# Altium project HDSP_watch.PrjPcb
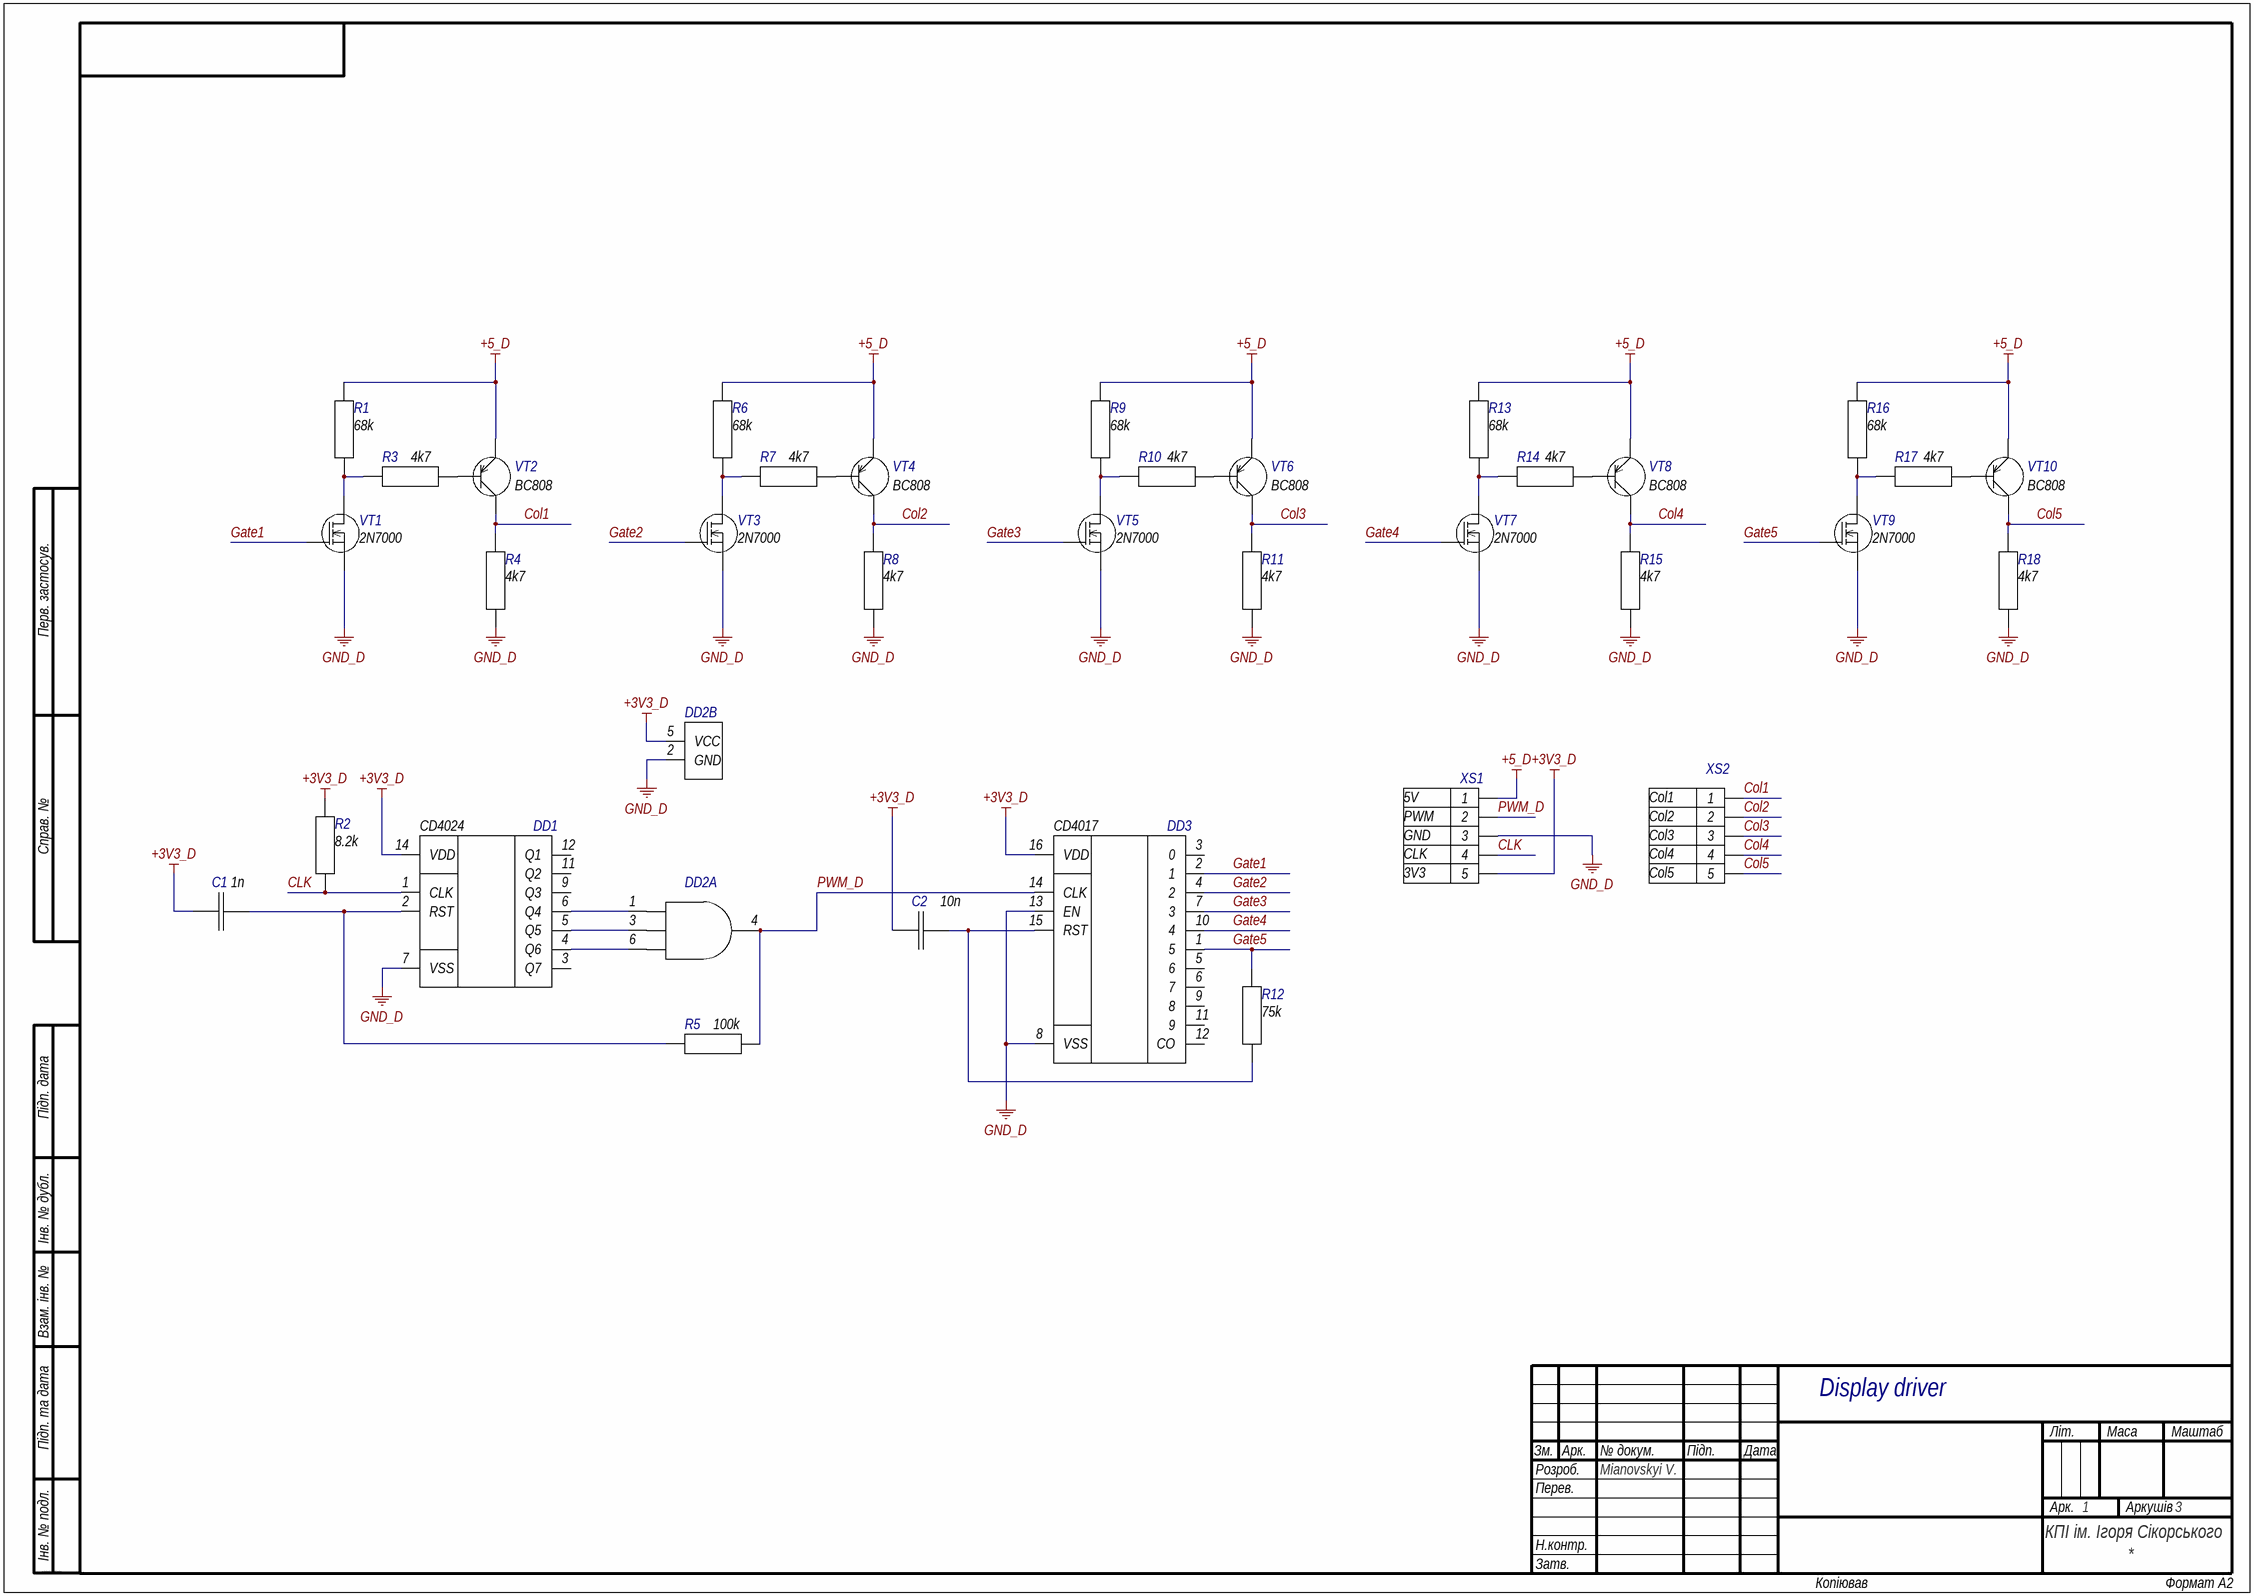
[diagram p0: Display_driver.SchDoc]
п_Разраб: Mianovskyi V.; п_Разраб_Р: Mianovskyi V.; п_Т_Контр: Mianovskyi V.
3 sheets, 86 parts. Net scope: global (net labels, ports and power ports of the same name join across sheets).
Board files: Control_core_copy.PcbDoc, Supply_core_PCB.PcbDoc, Display_driver_PCB.PcbDoc, Control_Supply_PCB.PcbDoc, Driver_PCB.PcbDoc
Sheets:
  Display_driver.SchDoc
  Supply_core.SchDoc
  Control_core.SchDoc

## Sheet Display_driver.SchDoc
size 594 x 420 mm; SheetNumber: 1; SheetTotal: 3

### Parts
C1  value 1n  [CHIP-0805]  (hidden comment: C0805)
C2  value 10n  [CHIP-0402]  (hidden comment: C0805)
DD1  CD4024  [SOIC-14]
DD2  74LVC1G11  [SOT23-6]  (value not drawn)  (parts A,B of 2)
DD3  CD4017  [SOIC-16]
R1  value 68k  [CHIP-0805]  (hidden comment: R0805)
R2  value 8.2k  [CHIP-0805]  (hidden comment: R0805)
R3  value 4k7  [CHIP-0402]  (hidden comment: R0805)
R4  value 4k7  [CHIP-0402]  (hidden comment: R0805)
R5  value 100k  [CHIP-0805]  (hidden comment: R0805)
R6  value 68k  [CHIP-0805]  (hidden comment: R0805)
R7  value 4k7  [CHIP-0402]  (hidden comment: R0805)
R8  value 4k7  [CHIP-0402]  (hidden comment: R0805)
R9  value 68k  [CHIP-0805]  (hidden comment: R0805)
R10  value 4k7  [CHIP-0402]  (hidden comment: R0805)
R11  value 4k7  [CHIP-0402]  (hidden comment: R0805)
R12  value 75k  [CHIP-0402]  (hidden comment: R0805)
R13  value 68k  [CHIP-0805]  (hidden comment: R0805)
R14  value 4k7  [CHIP-0402]  (hidden comment: R0805)
R15  value 4k7  [CHIP-0402]  (hidden comment: R0805)
R16  value 68k  [CHIP-0805]  (hidden comment: R0805)
R17  value 4k7  [CHIP-0402]  (hidden comment: R0805)
R18  value 4k7  [CHIP-0402]  (hidden comment: R0805)
VT1  2N7000  [SOT23-3]
VT2  BC808  [SOT23-3]
VT3  2N7000  [SOT23-3]
VT4  BC808  [SOT23-3]
VT5  2N7000  [SOT23-3]
VT6  BC808  [SOT23-3]
VT7  2N7000  [SOT23-3]
VT8  BC808  [SOT23-3]
VT9  2N7000  [SOT23-3]
VT10  BC808  [SOT23-3]
XS1  Pin5: 3V3  Pin4: CLK  Pin3: GND  Pin2: PWM  Pin1: 5V  [SOCKET]  (hidden comment: Socket)
XS2  Pin5: Col5  Pin4: Col4  Pin3: Col3  Pin2: Col2  Pin1: Col1  [SOCKET]  (hidden comment: Socket)

### Nets
+3V3_D: C1.1 C2.1 DD1.14(VDD) DD2.5(VCC) DD3.16(VDD) R2.2 XS1.5
+5_D: R1.2 R6.2 R9.2 R13.2 R16.2 VT2.2(E) VT4.2(E) VT6.2(E) VT8.2(E) VT10.2(E) XS1.1
GND_D: DD1.7(VSS) DD2.2(GND) DD3.8(VSS) DD3.13(EN) R4.1 R8.1 R11.1 R15.1 R18.1 VT1.2(S) VT3.2(S) VT5.2(S) VT7.2(S) VT9.2(S) XS1.3
CLK: DD1.1(CLK) R2.1 XS1.4
Col1: R4.2 VT2.3(C) XS2.1
Col2: R8.2 VT4.3(C) XS2.2
Col3: R11.2 VT6.3(C) XS2.3
Col4: R15.2 VT8.3(C) XS2.4
Col5: R18.2 VT10.3(C) XS2.5
Gate1: DD3.2(1) VT1.1(G)
Gate2: DD3.4(2) VT3.1(G)
Gate3: DD3.7(3) VT5.1(G)
Gate4: DD3.10(4) VT7.1(G)
Gate5: DD3.1(5) R12.2 VT9.1(G)
PWM_D: DD2.4(Y) DD3.14(CLK) R5.2 XS1.2
NetC1_2: C1.2 DD1.2(RST) R5.1
NetC2_2: C2.2 DD3.15(RST) R12.1
NetDD1_4: DD1.4(Q6) DD2.6(C)
NetDD1_5: DD1.5(Q5) DD2.3(B)
NetDD1_6: DD1.6(Q4) DD2.1(A)
NetR1_1: R1.1 R3.1 VT1.3(D)
NetR3_2: R3.2 VT2.1(B)
NetR6_1: R6.1 R7.1 VT3.3(D)
NetR7_2: R7.2 VT4.1(B)
NetR9_1: R9.1 R10.1 VT5.3(D)
NetR10_2: R10.2 VT6.1(B)
NetR13_1: R13.1 R14.1 VT7.3(D)
NetR14_2: R14.2 VT8.1(B)
NetR16_1: R16.1 R17.1 VT9.3(D)
NetR17_2: R17.2 VT10.1(B)

Not connected (* = marked no-connect by the designer): DD1 3(Q7) 9(Q3) 11(Q2) 12(Q1); DD3 3(0) 5(6) 6(7) 9(8) 11(9) 12(CO)

### Notes on the sheet
- Display driver
- Перв. застосув.
- Справ. №
- Підп. дата
- Інв. № дубл.
- Взам. інв. №
- Підп. та дата
- Зм.
- Розроб.
- Арк.
- № докум.
- Підп.
- Дата
- Літ.
- Маса
- Маштаб
- Перев.
- Аркушів
- Інв. № подл.
- Н.контр.
- Затв.
- КПІ ім. Ігоря Сікорського
- ALTIUM GOSTBOM2.0 KEV
- Копіював
- Формат А2

### Library data of the parts
DD1 = CD4024: Name: CD4024
DD3 = CD4017: Name: CD4017
VT1 VT3 VT5 VT7 VT9 = 2N7000: Name: 2N7000
VT2 VT4 VT6 VT8 VT10 = BC808: Name: BC808

## Sheet Supply_core.SchDoc
size 594 x 420 mm; SheetNumber: 2; SheetTotal: 3
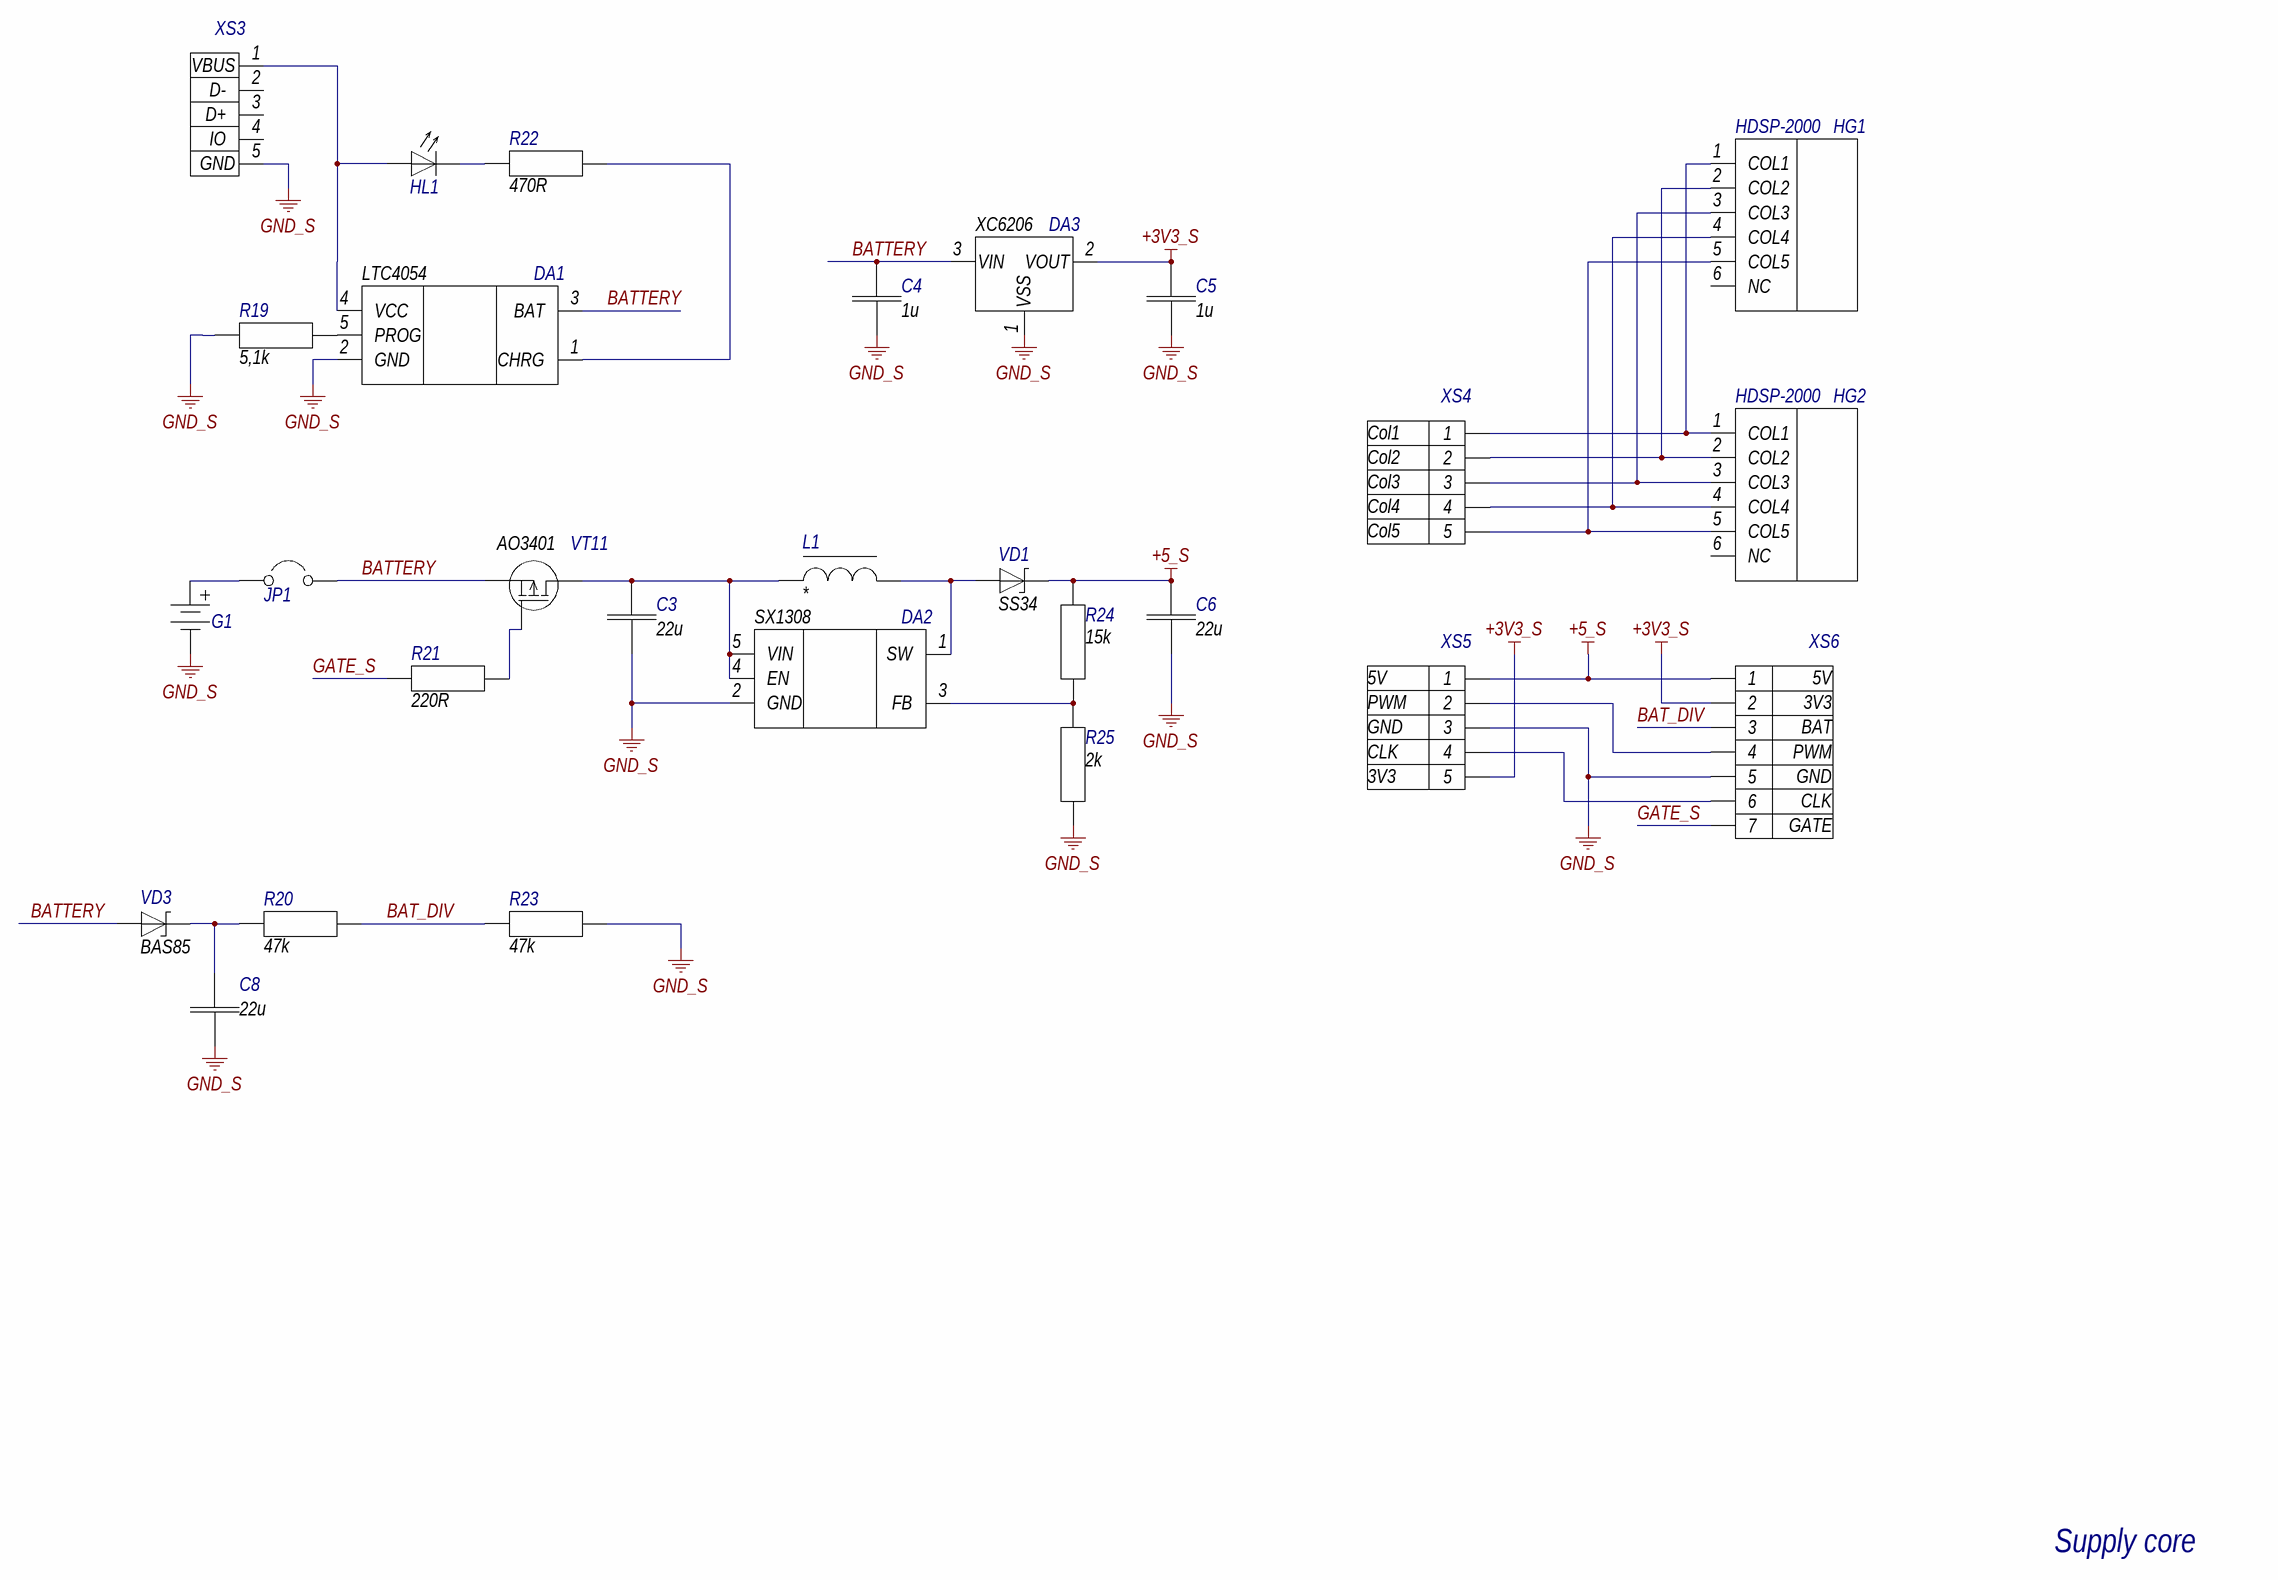
[diagram p1: Supply_core.SchDoc]

### Parts
C3  value 22u  [CHIP-0805]  (hidden comment: C0805)
C4  value 1u  [CHIP-0603]  (hidden comment: C0805)
C5  value 1u  [CHIP-0603]  (hidden comment: C0805)
C6  value 22u  [CHIP-0805]  (hidden comment: C0805)
C8  value 22u  [CHIP-0805]  (hidden comment: C0805)
DA1  LTC4054  [SOT23-5]
DA2  SX1308  [SOT23-6]
DA3  XC6206  [SOT23-3]
G1  Battery  [BATTERY]  (value not drawn)
HG1  Name: HDSP-2000  [HDSP-2000_COL]  (hidden comment: HDSP-2000_Colums)
HG2  Name: HDSP-2000  [HDSP-2000_COL]  (hidden comment: HDSP-2000_Colums)
HL1  LED  [LED_1]  (value not drawn)
JP1  Jamper  [JAMPER]  (value not drawn)
L1  L  [L_SMD]  (value not drawn)
R19  value 5,1k  [CHIP-0402]  (hidden comment: R0805)
R20  value 47k  [CHIP-0402]  (hidden comment: R0805)
R21  value 220R  [CHIP-0805]  (hidden comment: R0805)
R22  value 470R  [CHIP-0805]  (hidden comment: R0805)
R23  value 47k  [CHIP-0402]  (hidden comment: R0805)
R24  value 15k  [CHIP-0805]  (hidden comment: R0805)
R25  value 2k  [CHIP-0805]  (hidden comment: R0805)
VD1  SS34  [DIOD]
VD3  BAS85  [DIOD_MELF]
VT11  Name: AO3401  [SOT23-3]  (hidden comment: AO3401A)
XS3  Micro_USB  [Micro_USB]  (value not drawn)
XS4  Pin5: Col5  Pin4: Col4  Pin3: Col3  Pin2: Col2  Pin1: Col1  [SOCKET]  (hidden comment: Socket)
XS5  Pin5: 3V3  Pin4: CLK  Pin3: GND  Pin2: PWM  Pin1: 5V  [SOCKET]  (hidden comment: Socket)
XS6  Pin7: GATE  Pin6: CLK  Pin5: GND  Pin4: PWM  Pin3: BAT  Pin2: 3V3  Pin1: 5V  [SOCKET_7]  (hidden comment: Socket_7)

### Nets
+3V3_S: C5.2 DA3.2(VOUT) XS5.5 XS6.2
+5_S: C6.2 R24.2 VD1.1(K) XS5.1 XS6.1
GND_S: C3.1 C4.1 C5.1 C6.1 C8.1 DA1.2(GND) DA2.2(GND) DA3.1(VSS) G1.2 R19.1 R23.2 R25.1 XS3.5(GND) XS5.3 XS6.5
BAT_DIV: R20.2 R23.1 XS6.3
BATTERY: C4.2 DA1.3(BAT) DA3.3(VIN) JP1.2 VD3.2(A) VT11.2(S)
GATE_S: R21.1 XS6.7
NetC3_2: C3.2 DA2.4(EN) DA2.5(VIN) L1.1 VT11.3(D)
NetC8_2: C8.2 R20.1 VD3.1(K)
NetDA1_1: DA1.1(CHRG) R22.2
NetDA1_4: DA1.4(VCC) HL1.2(A) XS3.1(VBUS)
NetDA1_5: DA1.5(PROG) R19.2
NetDA2_1: DA2.1(SW) L1.2 VD1.2(A)
NetDA2_3: DA2.3(FB) R24.1 R25.2
NetG1_1: G1.1 JP1.1
NetHG1_1: HG1.1(COL1) HG2.1(COL1) XS4.1
NetHG1_2: HG1.2(COL2) HG2.2(COL2) XS4.2
NetHG1_3: HG1.3(COL3) HG2.3(COL3) XS4.3
NetHG1_4: HG1.4(COL4) HG2.4(COL4) XS4.4
NetHG1_5: HG1.5(COL5) HG2.5(COL5) XS4.5
NetHL1_1: HL1.1(K) R22.1
NetR21_2: R21.2 VT11.1(G)
NetXS5_2: XS5.2 XS6.4
NetXS5_4: XS5.4 XS6.6

Not connected (* = marked no-connect by the designer): HG1 6(NC); HG2 6(NC); XS3 2(D-) 3(D+) 4(IO)

### Notes on the sheet
- Supply core
- Перв. застосув.
- Справ. №
- Підп. дата
- Інв. № дубл.
- Взам. інв. №
- Підп. та дата
- Зм.
- Розроб.
- Арк.
- № докум.
- Підп.
- Дата
- Літ.
- Маса
- Маштаб
- Перев.
- Аркушів
- Інв. № подл.
- Н.контр.
- Затв.
- КПІ ім. Ігоря Сікорського
- ALTIUM GOSTBOM2.0 KEV
- Копіював
- Формат А2

### Library data of the parts
HG1 HG2 = HDSP-2000_Colums: Manufacturer: HP
DA1 = LTC4054: Name: LTC4054
DA2 = SX1308: Name: SX1308
DA3 = XC6206: Name: XC6206
HL1 = LED: Name: LED
L1 = L: Value: *
VD1 = SS34: Name: SS34
VD3 = BAS85: Name: BAS85

## Sheet Control_core.SchDoc
size 594 x 420 mm; SheetNumber: 3; SheetTotal: 3
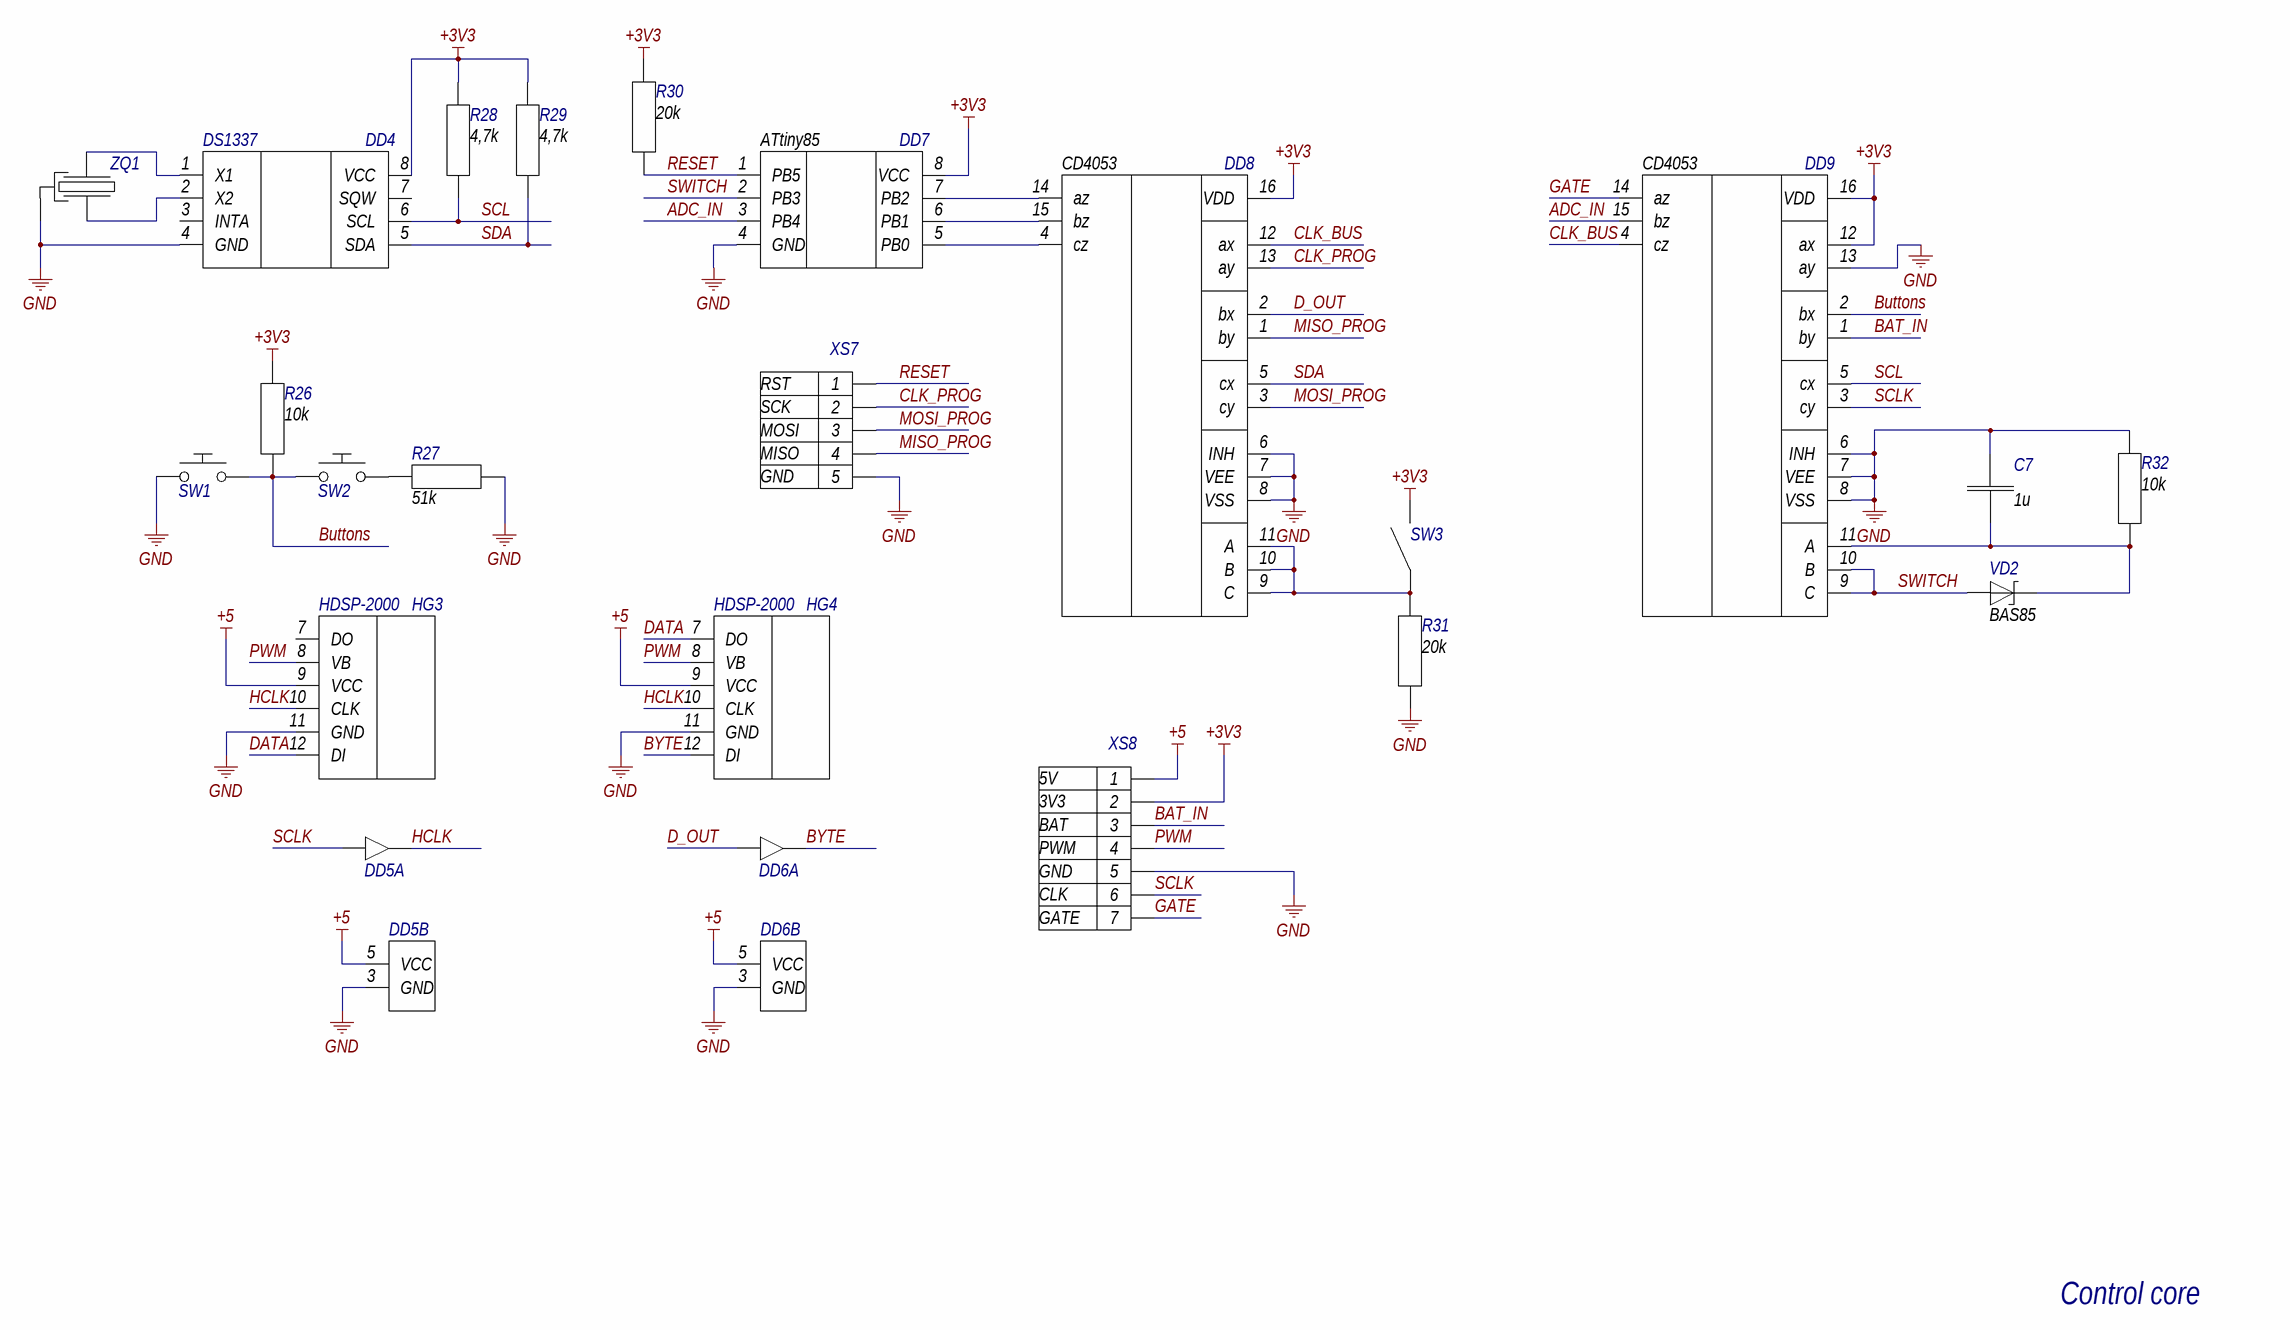
[diagram p2: Control_core.SchDoc]

### Parts
C7  value 1u  [CHIP-0805]  (hidden comment: C0805)
DD4  DS1337  [SOIC-8]
DD5  74LV1T34  [SOT23-5]  (value not drawn)  (parts A,B of 2)
DD6  74LV1T34  [SOT23-5]  (value not drawn)  (parts A,B of 2)
DD7  ATtiny85  [SOIC-8-ATtiny85]
DD8  CD4053  [SOIC-16]
DD9  CD4053  [SOIC-16]
HG3  Name: HDSP-2000  [HDSP-2000_SPI]  (hidden comment: HDSP-2000_SPI)
HG4  Name: HDSP-2000  [HDSP-2000_SPI]  (hidden comment: HDSP-2000_SPI)
R26  value 10k  [CHIP-0402]  (hidden comment: R0402)
R27  value 51k  [CHIP-0402]  (hidden comment: R0402)
R28  value 4,7k  [CHIP-0402]  (hidden comment: R0402)
R29  value 4,7k  [CHIP-0402]  (hidden comment: R0402)
R30  value 20k  [CHIP-0402]  (hidden comment: R0402)
R31  value 20k  [CHIP-0402]  (hidden comment: R0402)
R32  value 10k  [CHIP-0402]  (hidden comment: R0402)
SW1  Button  [BUTTON]  (value not drawn)
SW2  Button  [BUTTON]  (value not drawn)
SW3  Switch  [SWITCH]  (value not drawn)
VD2  BAS85  [DIOD_MELF]
XS7  Prog_connector  [Prog_connector]  (value not drawn)
XS8  Pin7: GATE  Pin6: CLK  Pin5: GND  Pin4: PWM  Pin3: BAT  Pin2: 3V3  Pin1: 5V  [SOCKET_7]  (hidden comment: Socket_7)
ZQ1  HZ  [HZ]  (value not drawn)

### Nets
+3V3: DD4.8(VCC) DD7.8(VCC) DD8.16(VDD) DD9.12(ax) DD9.16(VDD) R26.2 R28.2 R29.2 R30.2 SW3.2 XS8.2
+5: DD5.5(VCC) DD6.5(VCC) HG3.9(VCC) HG4.9(VCC) XS8.1
GND: C7.2 DD4.4(GND) DD5.3(GND) DD6.3(GND) DD7.4(GND) DD8.6(INH) DD8.7(VEE) DD8.8(VSS) DD9.6(INH) DD9.7(VEE) DD9.8(VSS) DD9.13(ay) HG3.11(GND) HG4.11(GND) R27.2 R31.2 R32.2 SW1.1 XS7.5 XS8.5 ZQ1.3
ADC_IN: DD7.3(PB4) DD9.15(bz)
BAT_IN: DD9.1(by) XS8.3
Buttons: DD9.2(bx) R26.1 SW1.2 SW2.1
BYTE: DD6.4(OUT) HG4.12(DI)
CLK_BUS: DD8.12(ax) DD9.4(cz)
CLK_PROG: DD8.13(ay) XS7.2
D_OUT: DD6.2(IN) DD8.2(bx)
DATA: HG3.12(DI) HG4.7(DO)
GATE: DD9.14(az) XS8.7
HCLK: DD5.4(OUT) HG3.10(CLK) HG4.10(CLK)
MISO_PROG: DD8.1(by) XS7.4
MOSI_PROG: DD8.3(cy) XS7.3
PWM: HG3.8(VB) HG4.8(VB) XS8.4
RESET: DD7.1(PB5) R30.1 XS7.1
SCL: DD4.6(SCL) DD9.5(cx) R28.1
SCLK: DD5.2(IN) DD9.3(cy) XS8.6
SDA: DD4.5(SDA) DD8.5(cx) R29.1
SWITCH: DD7.2(PB3) DD9.9(C) DD9.10(B) VD2.2(A)
NetC7_1: C7.1 DD9.11(A) R32.1 VD2.1(K)
NetDD4_1: DD4.1(X1) ZQ1.1
NetDD4_2: DD4.2(X2) ZQ1.2
NetDD7_5: DD7.5(PB0) DD8.4(cz)
NetDD7_6: DD7.6(PB1) DD8.15(bz)
NetDD7_7: DD7.7(PB2) DD8.14(az)
NetDD8_9: DD8.9(C) DD8.10(B) DD8.11(A) R31.1 SW3.1
NetR27_1: R27.1 SW2.2

Not connected (* = marked no-connect by the designer): DD4 3(INTA) 7(SQW); HG3 7(DO)

### Notes on the sheet
- Control core
- Перв. застосув.
- Справ. №
- Підп. дата
- Інв. № дубл.
- Взам. інв. №
- Підп. та дата
- Зм.
- Розроб.
- Арк.
- № докум.
- Підп.
- Дата
- Літ.
- Маса
- Маштаб
- Перев.
- Аркушів
- Інв. № подл.
- Н.контр.
- Затв.
- КПІ ім. Ігоря Сікорського
- ALTIUM GOSTBOM2.0 KEV
- Копіював
- Формат А2
- (in symbol Prog_connector) RST; SCK; MOSI; MISO; GND

### Library data of the parts
DD4 = DS1337: Manufacturer: Maxim; Name: DS1337
HG3 HG4 = HDSP-2000_SPI: Manufacturer: HP
DD7 = ATtiny85: Name: ATtiny85
DD8 DD9 = CD4053: Name: CD4053
VD2 = BAS85: Name: BAS85